# Altium schematic sheet 2012_FDP_Generic_Port_Act.SchDoc
size A4
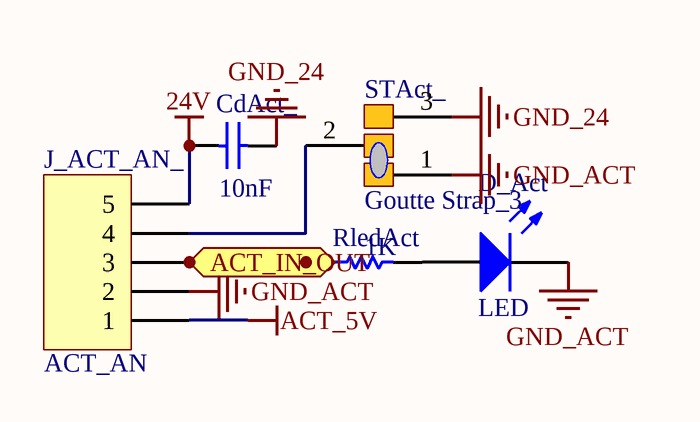
[diagram p0: 2012_FDP_Generic_Port_Act.SchDoc]

## Parts
CdAct_  10nF  [C0805_N]
D_Act  LED  [LED_0805]
J_ACT_AN_  ACT_AN  [HE14_5]
RledAct  1K  [R1206_N]
STAct_  Goutte Strap_3  [Goutte Strap_3]

## Ports
ACT_IN_OUT

## Nets
24V: CdAct_.1 J_ACT_AN_.5
ACT_5V: J_ACT_AN_.1
GND_24: CdAct_.2 STAct_.3
GND_ACT: D_Act.2(K) J_ACT_AN_.2 STAct_.1
ACT_IN_OUT: J_ACT_AN_.3 RledAct.1 ; port ACT_IN_OUT
NetD_Act_1: D_Act.1(A) RledAct.2
NetJ_ACT_AN__4: J_ACT_AN_.4 STAct_.2

## Library data of the parts
CdAct_ = Condensateur: Capacitor; Published: 8-Jun-2000; LatestRevisionDate: 17-Jul-2002; LatestRevisionNote: Re-released for DXP Platform.; PackageReference: RAD-0.3; Publisher: Altium Limited
D_Act = LED: Typical LED; Published: 8-Jun-2000; LatestRevisionDate: 08-Jul-2005; LatestRevisionNote: Mech Layer 1 removed.; PackageReference: LED-1; Publisher: Altium Limited
J_ACT_AN_ = BARRETTE5: Header, 5-Pin; LatestRevisionDate: 17-Jul-2002; LatestRevisionNote: Re-released for DXP Platform.; Publisher: Altium Limited
RledAct = Resistor: Published: 8-Jun-2000; LatestRevisionDate: 17-Jul-2002; LatestRevisionNote: Re-released for DXP Platform.; PackageReference: AXIAL-0.5; Publisher: Altium Limited
STAct_ = Goutte Strap_3: LatestRevisionDate: 25/11/09; Publisher: Damien Guitton